# EAGLE design LPC_2TE_3.5d (EAGLE 5.02)
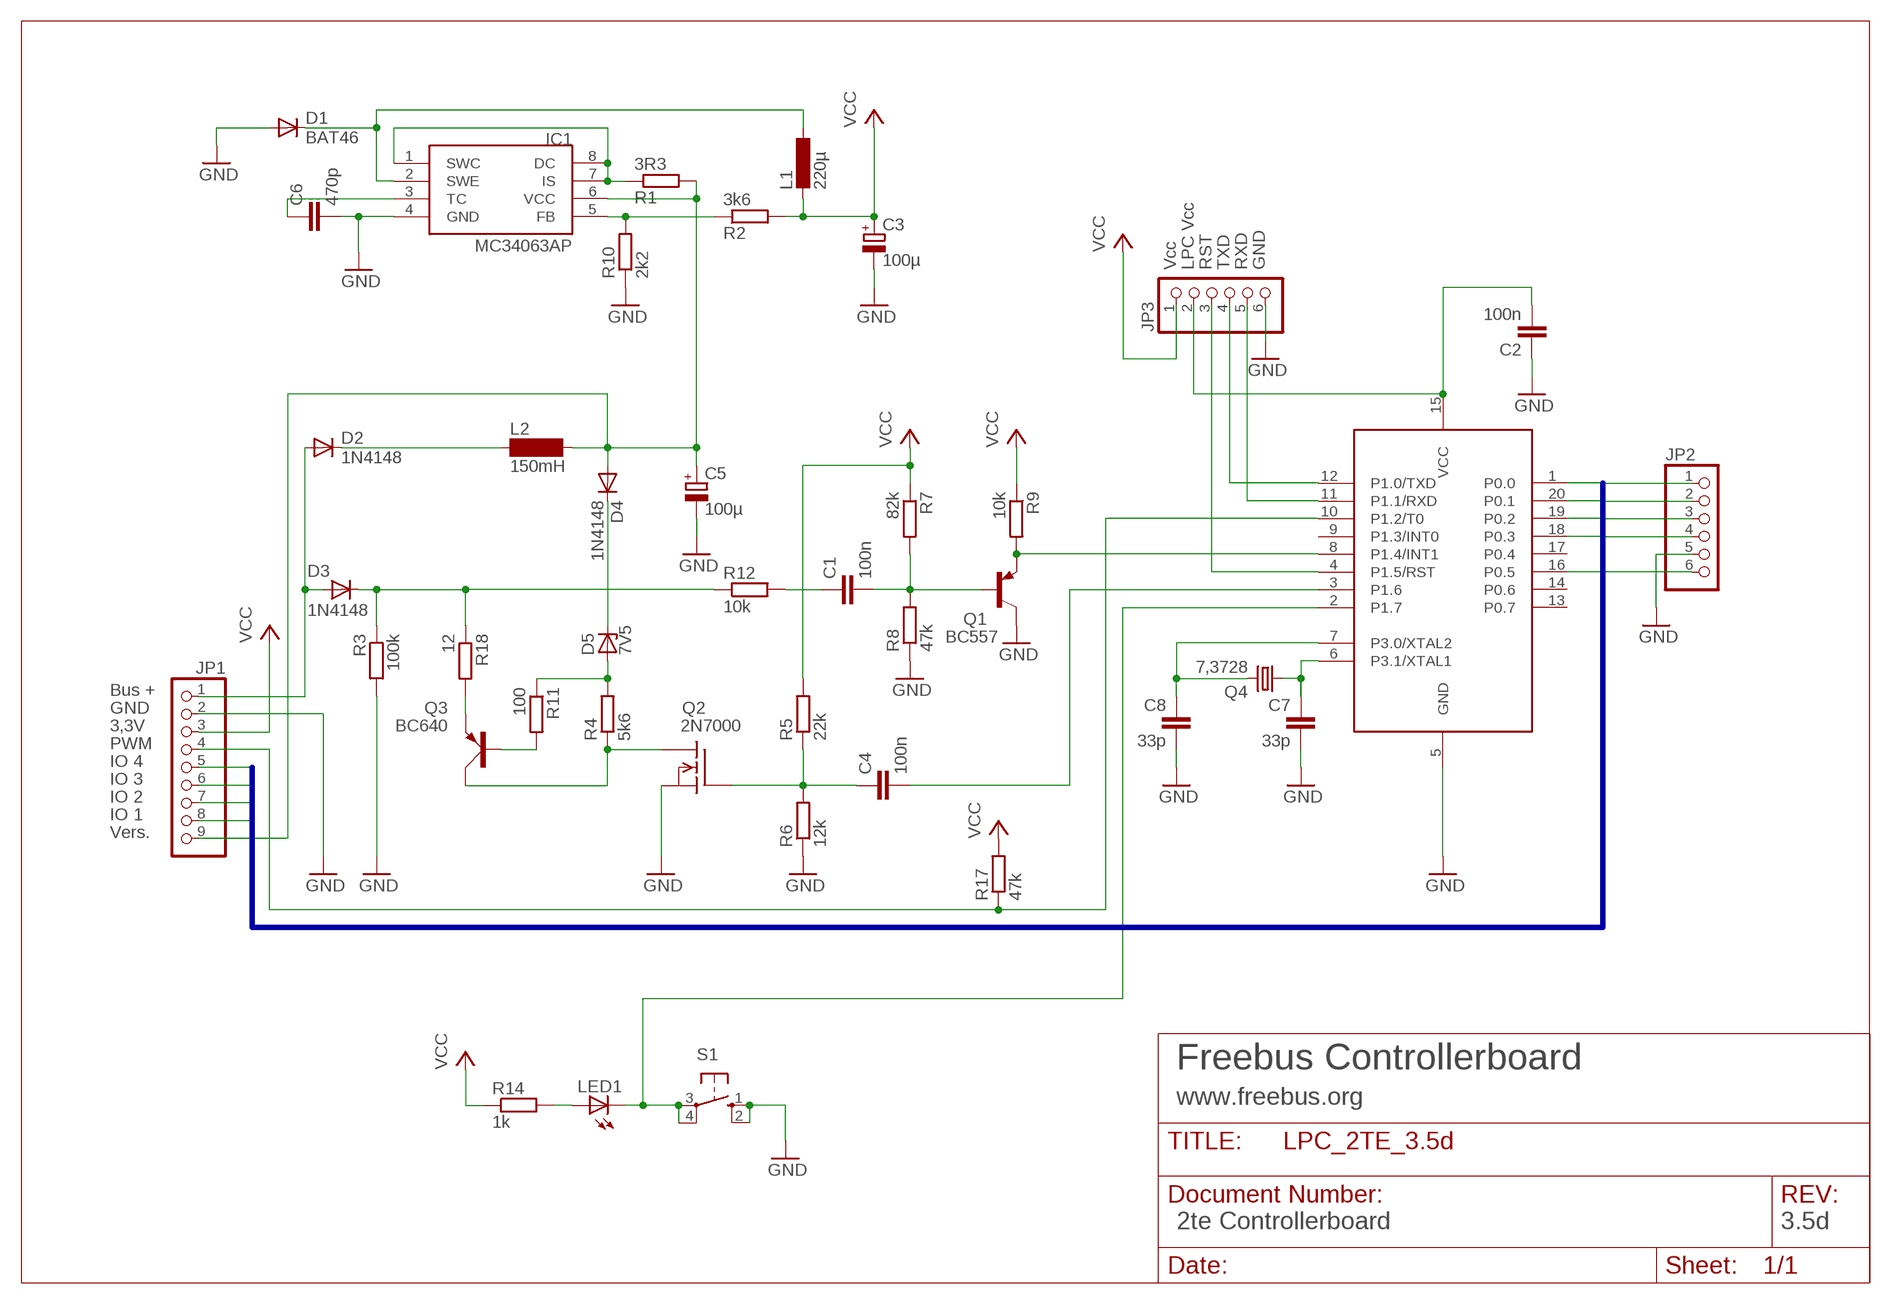
[diagram p0: schematic, sheet 1]

## Parts
89LPC922  89LPC922  [DIL20]
C1  100n  C-EU025-024X044  [C025-024X044]
C2  100n  C-EU025-024X044  [C025-024X044]
C3  100µ  CPOL-EUE2.5-6  [E2,5-6]
C4  100n  C-EU025-024X044  [C025-024X044]
C5  100µ  CPOL-EUE3.5-8  [E3,5-8]
C6  470p  C-EU025-024X044  [C025-024X044]
C7  33p  C-EU025-024X044  [C025-024X044]
C8  33p  C-EU025-024X044  [C025-024X044]
D1  BAT46  BAT81  [DO34-7]
D2  1N4148  1N4148STEHEND  [D-2.5]
D3  1N4148  DO35-STEHEND  [DO35-S]
D4  1N4148  [DO35-10]
D5  7V5  ZPDSTEHEND  [ZDIODE]
IC1  MC34063AP  [DIL08]
JP1  PINHD-1X9  [1X09]
JP2  PINHD-1X6  [1X06]
JP3  PINHD-1X6  [1X06]
L1  220µ  L-EU0207/12  [0207/12]
L2  150mH  BS11  [BS11]
LED1  LED3MM  [LED3MM]
Q1  BC557  [TO92]
Q2  2N7000  VN2222KM  [TO237]
Q3  BC640  [SOT54D]
Q4  7,3728  CRYSTALHC49S  [HC49/S]
R1  3R3  R-EU_0207/7  [0207/7@1]
R2  3k6  R-EU_0207/7  [0207/7@1]
R3  100k  R-EU_0207/2V  [0207/2V@1]
R4  5k6  R-EU_0207/2V  [0207/2V@1]
R5  22k  R-EU_0207/2V  [0207/2V@1]
R6  12k  R-EU_0207/2V  [0207/2V@1]
R7  82k  R-EU_0207/2V  [0207/2V@1]
R8  47k  R-EU_0207/2V  [0207/2V@1]
R9  10k  R-EU_0207/2V  [0207/2V@1]
R10  2k2  R-EU_0207/7  [0207/7@1]
R11  100  R-EU_0207/2V  [0207/2V@1]
R12  10k  R-EU_0207/2V  [0207/2V@1]
R14  1k  R-EU_0207/2V  [0207/2V@1]
R17  47k  R-EU_0207/2V  [0207/2V@1]
R18  12  R-EU_0207/2V  [0207/2V@1]
S1  10-XX  [B3F-10XX]

## Nets
EIB+: D2.A D3.P$1(A) JP1.1
GND: 89LPC922.5(GND) C2.1 C3.- C5.- C6.2 C7.2 C8.2 D1.A IC1.4(GND) JP1.2 JP2.5 JP3.6 Q1.3(C) Q2.3(S) R3.2 R6.1 R8.1 R10.1 S1.1(S) S1.2(S1)
N$1: 89LPC922.8(P1.4/INT1) Q1.1(E) R9.2
N$2: C1.2 Q1.2(B) R7.2 R8.2
N$3: 89LPC922.7(P3.0/XTAL2) C8.1 Q4.2
N$4: D3.P$2(B) R3.1 R12.1 R18.1
N$5: 89LPC922.3(P1.6) C4.2
N$6: 89LPC922.6(P3.1/XTAL1) C7.1 Q4.1
N$7: 89LPC922.2(P1.7) LED1.K(C) S1.3(P) S1.4(P1)
N$8: IC1.1(SWC) IC1.7(IS) IC1.8(DC) R1.1
N$9: LED1.A R14.2
N$10: C5.+ D4.A IC1.6(VCC) JP1.9 L2.2 R1.2
N$11: IC1.5(FB) R2.1 R10.2
N$12: D1.C IC1.2(SWE) L1.1
N$13: D2.C L2.1
N$14: C6.1 IC1.3(TC)
N$15: D4.C D5.C
N$16: C1.1 R12.2
N$25: D5.A R4.2 R11.1
N$26: Q2.1(D) Q3.C R4.1
N$28: Q3.B R11.2
N$29: 89LPC922.12(P1.0/TXD) JP3.4
N$30: 89LPC922.11(P1.1/RXD) JP3.5
N$31: 89LPC922.4(P1.5/RST) JP3.3
N$32: 89LPC922.15(VCC) C2.2 JP3.2
N$33: Q3.E R18.2
N$34: C4.1 Q2.2(G) R5.1 R6.2
N$42: 89LPC922.16(P0.5) JP2.6
P0.0: 89LPC922.1(P0.0) JP1.8 JP2.1
P0.1: 89LPC922.20(P0.1) JP1.7 JP2.2
P0.2: 89LPC922.19(P0.2) JP1.6 JP2.3
P0.3: 89LPC922.18(P0.3) JP1.5 JP2.4
PWM: 89LPC922.10(P1.2/T0) JP1.4 R17.1
VCC: C3.+ JP1.3 JP3.1 L1.2 R2.2 R5.2 R7.1 R9.1 R14.1 R17.2
Unconnected: 89LPC922.9(P1.3/INT0) 89LPC922.13(P0.7) 89LPC922.14(P0.6) 89LPC922.17(P0.4)

## Buses
P0.[0..3]

## Notes on the sheet
- Vcc | LPC Vcc | RST | TXD | RXD | GND
- Bus +
- GND
- 3,3V
- PWM
- IO 4
- IO 3
- IO 2
- IO 1
- Vers.
- Freebus Controllerboard
- www.freebus.org
- 2te Controllerboard | 3.5d

## Library data of the parts
89LPC922 = micro-philips:89LPC922
C1 C2 C4 C6-C8 = rcl:C-EU: CAPACITOR, European symbol
C3 C5 = rcl:CPOL-EU: POLARIZED CAPACITOR, European symbol
D1 = diode:BAT81: DIODE barrier diode
D2 D4 = diode:1N4148: DIODE high speed (Philips)
D3 = kubi:DO35-STEHEND
D5 = diode:ZPD: Z DIODE 500 mW
IC1 = mc34063:MC34063
JP1 = pinhead:PINHD-1X9: PIN HEADER
JP2 JP3 = pinhead:PINHD-1X6: PIN HEADER
L1 = rcl:L-EU: INDUCTOR, European symbol
L2 = inductor-neosid:BS: INDUCTOR nominal inductance, magnetically screened
LED1 = led:LED: LED OSRAM: - CHIPLED LG R971, LG N971, LY N971, LG Q971, LY Q971, LO R971, LY R971 LH N974, LH R974 LS Q976, LO Q976, LY Q976 LO Q996 - Hyper CHIPLED LW Q18S LB Q993, LB Q99A, LB R99A - SideLED LS A670, LO A670, LY A670, LG A670, LP A670 LB A673, LV A673, LT A673, LW A673 LH A674 LY A675 LS A676, LA A676, LO A676, LY A676, LW A676 LS A679, LY A679, LG A679 - Hyper Micro SIDELED® LS Y876, LA Y876, LO Y876, LY Y876 LT Y87S - SmartLED LW L88C, LW L88S LB L89C, LB L89S, LG L890 LS L89K, LO L89K, LY L89K LS L896, LA L896, LO L896, LY L896 - TOPLED LS T670, LO T670, LY T670, LG T670, LP T670 LSG T670, LSP T670, LSY T670, LOP T670, LYG T670 LG T671, LOG T671, LSG T671 LB T673, LV T673, LT T673, LW T673 LH T674 LS T676, LA T676, LO T676, LY T676, LB T676, LH T676, LSB T676, LW T676 LB T67C, LV T67C, LT T67C, LS T67K, LO T67K, LY T67K, LW E67C LS E67B, LA E67B, LO E67B, LY E67B, LB E67C, LV E67C, LT E67C LW T67C LS T679, LY T679, LG T679 LS T770, LO T770, LY T770, LG T770, LP T770 LB T773, LV T773, LT T773, LW T773 LH T774 LS E675, LA E675, LY E675, LS T675 LS T776, LA T776, LO T776, LY T776, LB T776 LHGB T686 LT T68C, LB T68C - Hyper Mini TOPLED® LB M676 - Mini TOPLED Santana® LG M470 LS M47K, LO M47K, LY M47K Source: http://www.osram.convergy.de - LUMILED® LXK2-PW12-R00, LXK2-PW12-S00, LXK2-PW14-U00, LXK2-PW14-V00 LXK2-PM12-R00, LXK2-PM12-S00, LXK2-PM14-U00 LXK2-PE12-Q00, LXK2-PE12-R00, LXK2-PE12-S00, LXK2-PE14-T00, LXK2-PE14-U00 LXK2-PB12-K00, LXK2-PB12-L00, LXK2-PB12-M00, LXK2-PB14-N00, LXK2-PB14-P00, LXK2-PB14-Q00 LXK2-PR12-L00, LXK2-PR12-M00, LXK2-PR14-Q00, LXK2-PR14-R00 LXK2-PD12-Q00, LXK2-PD12-R00, LXK2-PD12-S00 LXK2-PH12-R00, LXK2-PH12-S00 LXK2-PL12-P00, LXK2-PL12-Q00, LXK2-PL12-R00 Source: www.luxeon.com
Q1 = transistor-pnp:BC557: PNP Transistor
Q2 = transistor-fet:VN2222KM: N-Channel Enhancement MOSFET (VMOS); 60V; 0,5A; 7,5Ohm
Q3 = transistor-small-signal:BC640: PNP TRANSISTOR
Q4 = crystal:CRYSTAL: CRYSTAL
R1-R12 R14 R17 R18 = rcl:R-EU_: RESISTOR, European symbol
S1 = switch-omron:10-XX: OMRON SWITCH

## Board
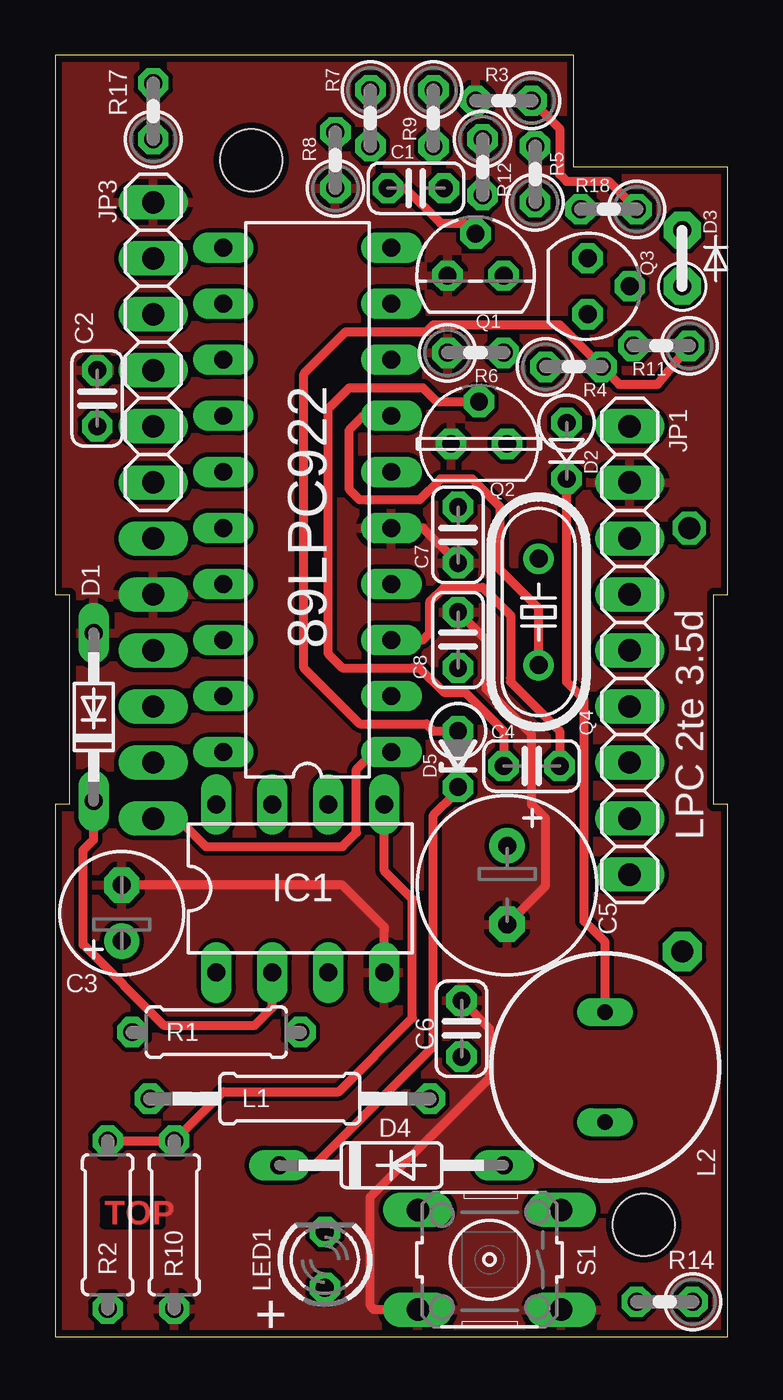
[diagram p1: board, top side]
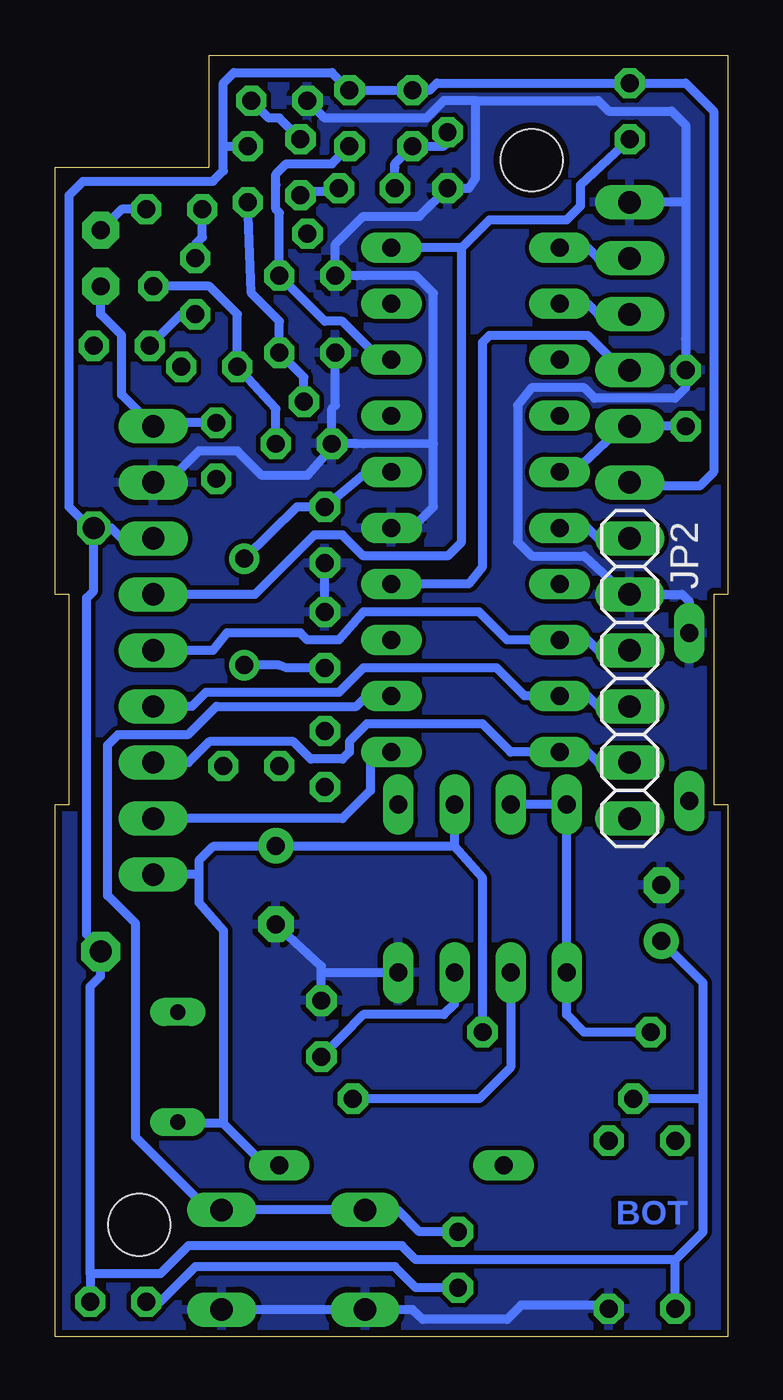
[diagram p2: board, bottom side, seen from below]

Size 30.48 x 58.1 mm. Coordinates in mm from the lower left corner, seen from the top.
Outline: 0,0 30.48,0 30.48,24.13 29.85,24.13 29.85,33.65 30.48,33.65 30.48,53.02 23.5,53.02 23.5,58.1 0,58.1 0,33.65 0.64,33.65 0.64,24.13 0,24.13 0,0
Copper layers (1*16): Top 0.035mm / dielectric 1.5mm / Bottom 0.035mm
Design rules "default_freebus": minimum track width 10mil, minimum drill 24mil, track to track 8mil, track to pad 8mil, pad to pad 8mil, via to via 8mil, smd to smd 8mil, copper to edge 12mil, drill to drill 8mil, minimum pad ring 11mil, minimum via ring 8mil, stop-mask expansion 4mil, vias tented up to drill 0mil, thermal gap 10mil
Holes 2.8 mm at 26.67,5.08 8.89,53.34

### Footprints (pad centres in the part's own frame; a part is rotated, then mirrored left to right if it is on the bottom)
DIL20 = drill 0.813 long: 1 -11.43,-3.81; 2 -8.89,-3.81; 3 -6.35,-3.81; 4 -3.81,-3.81; 5 -1.27,-3.81; 6 1.27,-3.81; 7 3.81,-3.81; 8 6.35,-3.81; 9 8.89,-3.81; 10 11.43,-3.81; 11 11.43,3.81; 12 8.89,3.81; 13 6.35,3.81; 14 3.81,3.81; 15 1.27,3.81; 16 -1.27,3.81; 17 -3.81,3.81; 18 -6.35,3.81; 19 -8.89,3.81; 20 -11.43,3.81
C025-024X044 = drill 0.813 octagon: 1 -1.27,0; 2 1.27,0
E2,5-6 = drill 0.813 pad 1.6 round: + -1.27,0 | drill 0.813 pad 1.6 octagon: - 1.27,0
E3,5-8 = drill 0.813 pad 1.6 round: + -1.778,0 | drill 0.813 pad 1.6 octagon: - 1.778,0
DO34-7 = drill 0.813 long: A 3.81,0; C -3.81,0
D-2.5 = drill 0.813 octagon: A 1.27,0; C -1.27,0
DO35-S = drill 0.8 pad 1.676 octagon: P$1 -1.27,0; P$2 1.27,0
DO35-10 = drill 0.813 long: A 5.08,0; C -5.08,0
ZDIODE = drill 0.813 octagon: A 1.27,0; C -1.27,0
DIL08 = drill 0.813 long: 1 -3.81,-3.81; 2 -1.27,-3.81; 3 1.27,-3.81; 4 3.81,-3.81; 5 3.81,3.81; 6 1.27,3.81; 7 -1.27,3.81; 8 -3.81,3.81
1X09 = drill 1.016 long: 1 -10.16,0; 2 -7.62,0; 3 -5.08,0; 4 -2.54,0; 5 0,0; 6 2.54,0; 7 5.08,0; 8 7.62,0; 9 10.16,0
1X06 = drill 1.016 long: 1 -6.35,0; 2 -3.81,0; 3 -1.27,0; 4 1.27,0; 5 3.81,0; 6 6.35,0
0207/12 = drill 0.813 octagon: 1 -6.35,0; 2 6.35,0
BS11 = drill 0.7 long: 1 -2.5,0; 2 2.5,0
LED3MM = drill 0.813 octagon: A -1.27,0; K 1.27,0
TO92 = drill 0.813 octagon: 1 1.27,0; 2 0,1.905; 3 -1.27,0
TO237 = drill 0.813 octagon: 1 1.27,0; 2 0,1.905; 3 -1.27,0
SOT54D = drill 0.813 octagon: B 1.27,0; C 0,1.905; E -1.27,0
HC49/S = drill 0.813 round: 1 -2.413,0; 2 2.413,0
0207/7@1 = drill 0.813 octagon: 1 -3.81,0; 2 3.81,0
0207/2V@1 = drill 0.813 octagon: 1 -1.27,0; 2 1.27,0
B3F-10XX = drill 1.016 long: 1 -3.251,2.261; 2 3.251,2.261; 3 -3.251,-2.261; 4 3.251,-2.261

### Placement (x,y rotation side)
89LPC922  11.43,37.94 90 top
C1  16.35,52.07 180 top
C2  1.91,42.54 270 top
C3  3.02,19.21 90 top
C4  21.59,25.88 0 top
C5  20.48,20.48 270 top
C6  18.42,13.97 90 top
C7  18.26,36.35 270 top
C8  18.26,31.59 90 top
D1  1.75,28.1 90 top
D2  23.18,40.16 90 top
D3  28.42,48.9 90 top
D4  15.24,7.78 0 top
D5  18.26,26.19 90 top
IC1  11.11,20.32 0 top
JP1  26.04,31.12 270 top
JP2  4.45,29.84 90 bottom
JP3  4.45,45.08 90 top
L1  10.64,10.79 180 top
L2  24.92,12.22 270 top
LED1  12.22,3.49 90 top
Q1  19.05,48.1 0 top
Q2  19.21,40.48 0 top
Q3  24.13,47.62 270 top
Q4  21.91,32.86 270 top
R1  7.3,13.81 0 top
R2  2.38,5.08 270 top
R3  20.32,56.04 180 top
R4  23.5,43.97 0 top
R5  21.75,52.7 90 top
R6  19.05,44.61 0 top
R7  14.29,55.24 270 top
R8  12.7,53.34 90 top
R9  17.14,55.24 270 top
R10  5.4,5.08 90 top
R11  27.46,44.93 180 top
R12  19.37,53.02 270 top
R14  27.62,1.59 180 top
R17  4.45,55.56 90 top
R18  25.08,51.12 180 top
S1  19.69,3.49 180 top

### Tracks (layer width: path | path; a pad name or v marks a point on that pad's centre or on a via)
EIB+
  Bottom 0.406: D3.P$1 28.42,46.35 27.46,45.4 27.46,42.7 JP1.1 | JP1.1 | D2.A 24.92,41.43 25.08,41.27 JP1.1 | JP1.1
GND
  Top 0.406: 89LPC922.5 16.67,36.67 C7.2 | S1.2 14.45,1.23 14.29,1.43 14.29,6.35 19.69,11.75 19.69,13.97 C6.2 | C6.2 | C6.2 | IC1.4 | IC1.4 14.92,18.41 14.92,18.57 13.02,20.48 C3.- | C3.- | C8.2 19.53,31.59 19.53,29.37 21.59,27.3 21.59,24.13 22.23,23.49 22.23,20.45 C5.-
  Bottom 0.406: 13.34,40.48 16.51,40.48 16.83,40.48 Q2.3 | 13.34,40.48 13.34,47.31 14.13,48.1 16.51,48.1 16.83,48.1 Q1.3 17.78,49.53 16.51,50.8 13.97,50.8 R8.1 11.75,52.07 11.43,52.55 11.43,56.04 | 89LPC922.5 14.29,36.67 13.34,37.62 13.34,40.48 | Q2.3 | Q2.3 17.94,42.07 17.78,42.23 R6.1 | 1.91,45.24 1.91,43.02 2.38,42.54 6.03,42.54 6.51,43.02 8.89,43.02 9.53,42.23 9.53,36.04 8.89,35.4 6.51,35.4 4.6,33.65 JP2.5 2.86,33.65 2.06,33.65 1.75,33.34 D1.A | 1.91,51.43 1.91,45.24 | 1.91,51.43 JP3.6 | 11.43,56.04 5.87,56.04 5.4,55.56 2.54,55.56 1.91,54.93 | 17.94,40.32 19.05,39.05 21.11,39.05 22.23,40.16 22.38,40.16 23.97,40.16 25.4,38.73 JP1.2 | 17.78,55.24 | 17.78,55.24 18.26,55.24 R3.2 | 16.99,55.24 13.65,55.24 12.86,56.04 11.43,56.04 | 16.99,55.24 | 16.99,55.24 17.78,55.24 | C2.1 1.91,44.13 1.91,45.24 | 1.91,51.43 | 1.91,54.93 | 1.91,54.93 1.91,51.43 | C8.2 C7.2 | D1.A | D1.A | 21.59,1.23 S1.1 | 21.59,1.23 S1.2 14.29,1.23 13.81,0.79 10,0.79 9.37,1.43 5.4,1.43 | 21.59,1.23 21.59,1.27 | 17.94,40.32 | Q2.3 17.94,40.32 | C6.2 | 18.42,16.51 IC1.4 | C6.2 18.42,16.51 | 5.4,1.43 | R10.1 5.4,1.43 | C5.- 18.42,16.8 18.42,16.51
  pour Bottom: 0,58.1 23.5,58.1 23.5,53.02 30.48,53.02 30.48,33.65 29.85,33.65 29.85,24.13 30.48,24.13 30.48,0 0,0 0,24.13 0.64,24.13 0.64,33.65 0,33.65
  pour Top: 0,58.1 23.5,58.1 23.5,53.02 30.48,53.02 30.48,33.65 29.85,33.65 29.85,24.13 30.48,24.13 30.48,0 0,0 0,24.13 0.64,24.13 0.64,33.65 0,33.65
N$1
  Bottom 0.406: 89LPC922.8 15.72,44.29 | 15.72,44.29 | 15.72,44.29 17.46,46.04 18.26,46.04 Q1.1 20.32,50.96 20.48,51.12 20.48,52.23 20.48,52.7 20,53.18 17.94,53.18 R9.2
N$2
  Top 0.406: C1.2 15.88,52.07 17.46,50.48 18.57,50.48 Q1.2
  Bottom 0.406: R8.2 12.7,54.13 12.86,53.97 R7.2 15.08,53.18 15.08,53.02 15.08,52.7 C1.2
N$3
  Top 0.406: 89LPC922.7 14.29,41.75 13.97,41.75 13.34,41.12 13.34,38.42 13.81,37.94 16.51,37.94 17.46,38.89 18.89,38.89 20.16,37.62 20.16,34.77 21.91,33.02 Q4.2
  Bottom 0.406: Q4.2 20.32,30.45 20,30.32 C8.1
N$4
  Top 0.406: R18.1 25.08,52.39 23.18,52.39 22.86,52.7 22.86,54.77 R3.1
  Bottom 0.406: D3.P$2 27.46,51.12 R18.1 | R12.1 19.84,54.77 20.32,55.24 20.8,55.24 R3.1 | R3.1 | R3.1
N$5
  Top 0.406: C4.2 22.86,27.46 20.64,29.69 20.64,29.84 20.64,32.7 19.37,33.97 17.62,33.97 16.99,33.34 16.99,31.91 16.67,31.59 89LPC922.3
N$6
  Bottom 0.406: Q4.1 19.53,37.62 C7.1 16.35,39.21 15.4,39.21 89LPC922.6
N$7
  Bottom 0.406: 15.52,5.75 14.96,5.75 13.97,4.76 LED1.K | S1.4 15.96,5.8 15.88,5.71 15.52,5.75 | 15.52,5.75 S1.4 | S1.4 S1.3 21.63,5.75 21.59,5.71 21.75,5.71 23.5,5.71 26.83,9.05 26.83,18.73 28.1,20 28.1,26.83 27.62,27.3 24.45,27.3 23.18,28.57 16.83,28.57 16.35,29.05 15.72,29.05 89LPC922.2
N$8
  Bottom 0.406: IC1.7 | IC1.8 IC1.7 | IC1.7 | IC1.8 | IC1.1 IC1.8 | R1.1 5.24,13.81 6.51,13.81 7.3,14.6 IC1.1 | IC1.1 | IC1.1
N$9
  Bottom 0.406: LED1.A 14.13,2.22 15.08,3.17 24.13,3.17 25.72,1.59 R14.2
N$10
  Bottom 0.406: IC1.6 | IC1.6 | 12.38,22.22 IC1.6 | D4.A 20.96,7.78 22.86,9.68 | L2.2 24.92,9.68 22.86,9.68 | 23.97,20.95 JP1.9 | 23.97,20.95 23.97,19.68 22.86,18.41 22.86,9.68 | 12.38,22.22 20.48,22.22 | 20.48,22.22 23.34,22.22 23.97,21.59 23.97,20.95 | 23.97,20.95 | R1.2 11.11,13.97 11.11,20.8 12.38,22.22 | C5.+ | 20.48,22.22 C5.+
N$11
  Top 0.406: IC1.5 | IC1.5 | IC1.5 14.92,21.11 16.19,19.84 16.19,14.45 12.86,11.11 7.62,11.11 R10.2 2.54,8.89 R2.1 | R2.1
N$12
  Top 0.406: IC1.2 9.84,14.92 9.05,14.13 4.92,14.13 1.27,17.78 1.27,22.07 1.75,22.54 D1.C
  Bottom 0.406: IC1.2 | IC1.2 | L1.1 11.27,10.79 9.84,12.22 IC1.2
N$13
  Top 0.406: D2.C | D2.C 23.18,29.69 23.97,28.89 23.97,18.85 24.92,17.9 24.92,15.56 L2.1
N$14
  Bottom 0.406: IC1.3 | IC1.3 12.38,15.08 12.86,14.6 16.51,14.6 17.46,13.65 C6.1 | C6.1
N$15
  Top 0.406: D4.C 11.75,7.78 17.15,13.18 17.15,23.65 18.1,24.61 | 18.1,24.61 D5.C | 18.1,24.61
N$16
  Bottom 0.406: R12.2 19.37,51.91 17.62,51.91 C1.1 | C1.1
N$25
  Top 0.406: R11.1 27.31,43.18 25.56,43.18 R4.2 22.86,45.88 17.15,45.88 16.83,45.56 13.18,45.56 11.27,43.66 11.27,30.32 13.81,27.78 16.83,27.78 17.15,27.46 18.1,27.46 D5.A
N$26
  Bottom 0.406: Q3.C 23.5,47.62 22.23,46.35 R4.1 | Q2.1 20.48,42.07 R4.1 | R4.1
N$28
  Bottom 0.406: R11.2 24.77,46.35 Q3.B
N$29
  Bottom 0.406: JP3.4 5.87,46.35 6.35,46.83 89LPC922.12
N$30
  Bottom 0.406: JP3.5 5.87,48.89 6.35,49.37 89LPC922.11
N$31
  Bottom 0.406: 89LPC922.4 11.75,34.13 11.11,34.92 11.11,45.08 10.8,45.4 6.35,45.4 4.76,43.81 JP3.3
N$32
  Bottom 0.406: JP3.2 4.76,41.27 6.99,39.21 89LPC922.15 | JP3.2 | C2.2 3.18,41.27 JP3.2
N$33
  Bottom 0.406: Q3.E 24.13,48.58 24.13,49.53 23.81,49.85 R18.2
N$34
  Top 0.406: 13.34,43.02 12.38,42.07 12.38,30.96 13.02,30.32 16.19,30.32 16.51,30.32 17.62,29.21 18.57,29.21 20.32,27.46 C4.1 | 13.34,43.02 | 13.34,43.02 16.67,43.02 17.3,42.39 Q2.2
  Bottom 0.406: Q2.2 19.21,43.5 R6.2 20.32,46.04 21.59,47.31 R5.1
N$42
  Bottom 0.406: 6.35,36.67 6.51,36.67 | 6.35,36.67 6.67,36.67 89LPC922.16 | JP2.6 | JP2.6 5.87,36.19 6.35,36.67
P0.0
  Top 0.406: JP2.1 5.56,23.49 6.83,22.22 13.02,22.22 13.65,22.86 13.65,25.72 | 13.65,25.72 | 13.65,25.72 14.45,26.51 14.92,26.51 89LPC922.1 | 89LPC922.1
  Bottom 0.406: JP1.8 17.46,23.49 16.19,24.76 16.19,26.03 15.72,26.51 89LPC922.1
P0.1
  Bottom 0.406: JP2.2 5.87,26.03 6.35,26.51 89LPC922.20 7.78,26.51 | JP1.7 24.45,26.03 23.5,26.99 19.69,26.99 18.89,26.19 17.46,26.19 17.15,26.51 17.15,26.99 16.35,27.78 11.11,27.78 9.84,26.51 7.78,26.51 | 7.78,26.51
P0.2
  Bottom 0.406: JP2.3 5.87,28.57 6.35,29.05 89LPC922.19 | JP1.6 24.29,28.57 23.65,29.21 17.62,29.21 16.51,30.32 10.48,30.32 9.21,29.05 89LPC922.19 | 89LPC922.19 | 89LPC922.19
P0.3
  Bottom 0.406: JP1.5 23.34,31.11 22.7,31.91 19.37,31.91 19.05,31.59 17.62,31.59 16.51,32.86 11.27,32.86 10,31.59 89LPC922.18 6.35,31.59 5.87,31.11 JP2.4
PWM
  Bottom 0.406: 12.07,49.37 12.07,36.04 12.7,35.4 16.51,35.4 17.46,36.35 18.73,36.35 21.43,33.65 22.86,33.65 JP1.4 | 12.07,49.37 89LPC922.10 | 12.07,49.37 10.8,50.64 7.3,50.64 6.67,51.28 6.67,52.23 R17.1
VCC  (via drill 1, 1 pad 1.78)
  Bottom 0.406: JP3.1 4.29,38.58 3.18,38.58 1.27,38.58 0.64,39.21 0.64,55.56 1.91,56.83 R17.2 | 22.86,53.97 22.86,52.86 23.34,52.39 29.21,52.39 29.85,51.75 29.85,37.62 29.05,36.83 29.05,36.51 v28.73,36.67 | 22.86,53.97 22.86,56.83 22.38,57.31 17.94,57.31 R9.1 | R17.2 13.18,56.83 13.49,56.51 R7.1 R9.1 | R9.1 | 28.89,2.86 R14.1 | 10.64,3.49 6.19,3.49 2.38,3.49 | 10.64,3.49 14.13,3.49 14.76,4.13 24.45,4.13 25.72,2.86 28.89,2.86 | v28.73,36.67 27.94,36.67 27.46,36.19 JP1.3 | v28.73,36.67 28.73,33.81 29.05,33.5 29.05,18.26 v28.42,17.46 28.42,16.35 28.89,15.87 28.89,2.86 | v28.73,36.67 29.05,36.35 29.21,36.51 | R17.2 | 28.89,2.86 | 28.89,2.86 | 10.64,3.49 | 1.11,10.79 1.11,4.76 2.38,3.49 | 2.38,3.49 | C3.+ 1.11,16.03 1.11,15.56 1.11,12.22 1.11,10.79 | 1.11,10.79 L1.2 | R2.2 | R2.2 2.38,3.49 | 22.86,53.97 | 22.86,53.97 R5.2

### Text on the board
Top: TOP
Bottom: BOT
tPlace: +
tNames: LPC 2te 3.5d